# EasyEDA Pro project rp2040-mlx90393_1.epro

# Schematic Schematic3_4
Create Date: 2025-07-02; Page Name: P1; Project Name: RSCM; Schematic Name: Schematic3_4; Update Date: 2025-07-02; Company: 嘉立创EDA; Page Size: A4; Version: V1.0
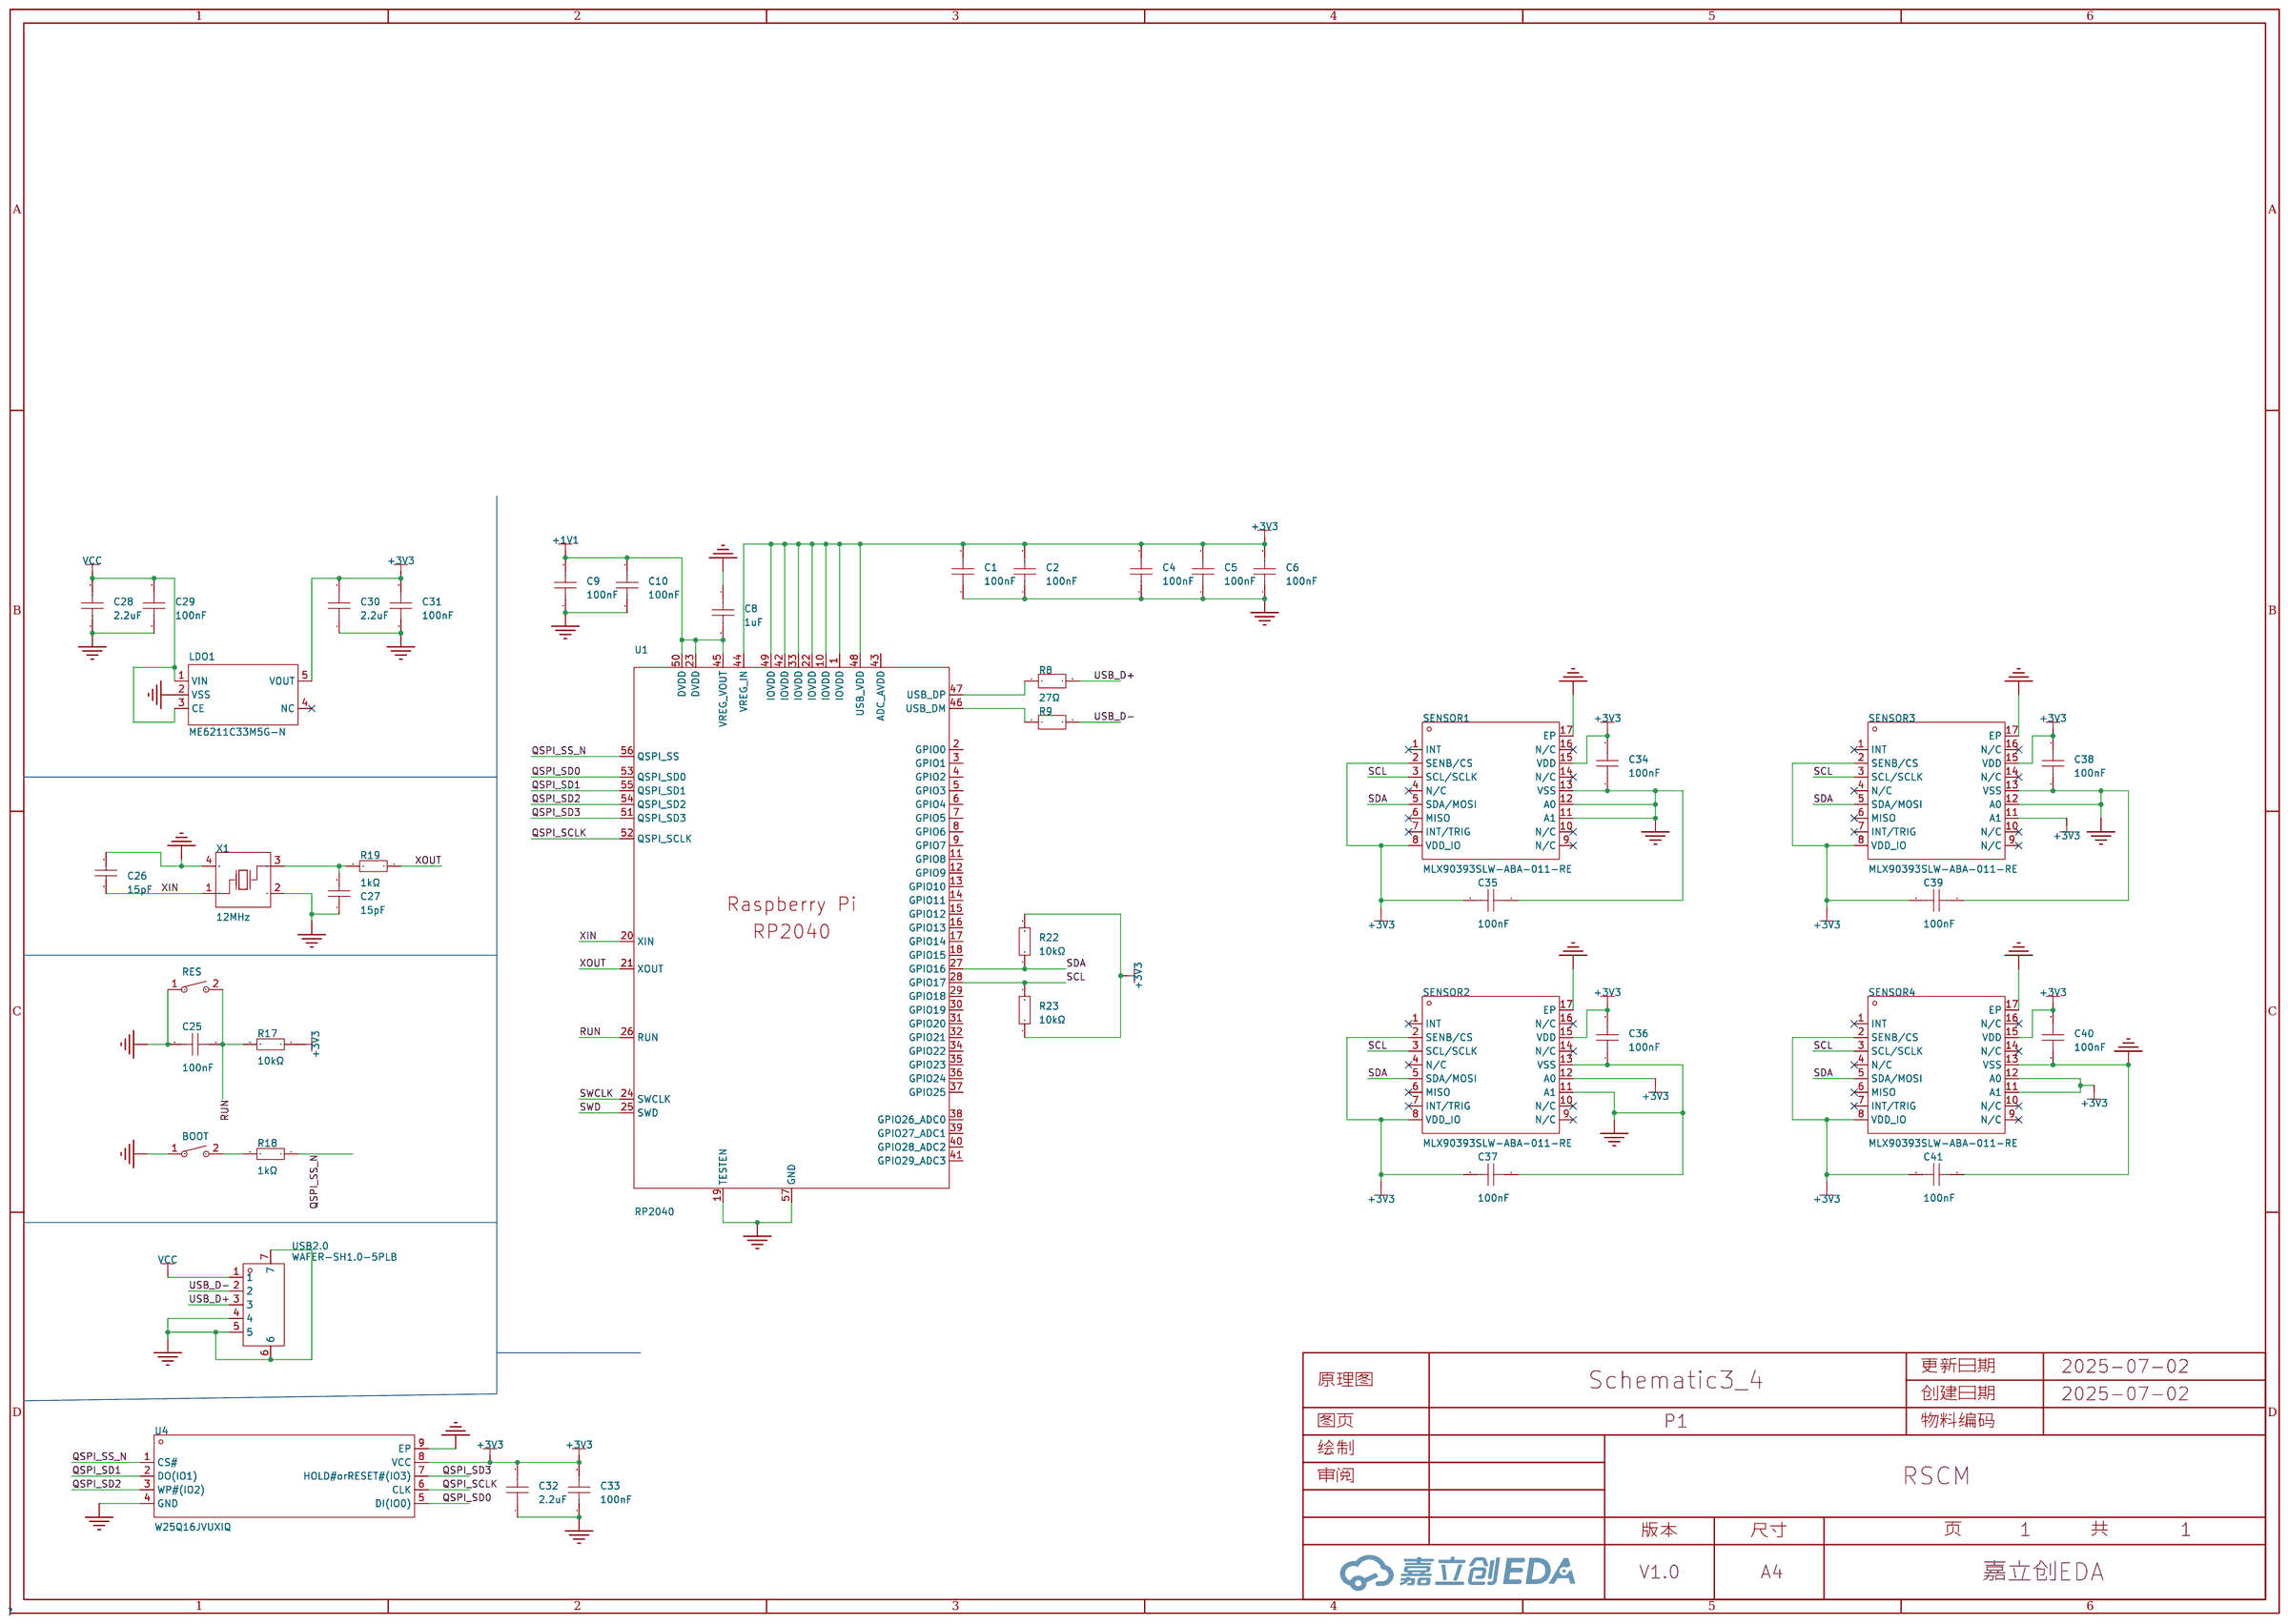
[diagram p0: schematic sheet]

## Parts
BOOT  TS-1071AD-A1B3-D4  [SW-SMD_L4.0-W3.0-LS4.8]
C1  100nF  [C0603]
C2  100nF  [C0603]
C4  100nF  [C0603]
C5  100nF  [C0603]
C6  100nF  [C0603]
C8  1uF  [C0603]
C9  100nF  [C0603]
C10  100nF  [C0603]
C25  100nF  [C0603]
C26  15pF  [C0603]
C27  15pF  [C0603]
C28  2.2uF  [C0603]
C29  100nF  [C0603]
C30  2.2uF  [C0603]
C31  100nF  [C0603]
C32  2.2uF  [C0603]
C33  100nF  [C0603]
C34  100nF  [C0603]
C35  100nF  [C0603]
C36  100nF  [C0603]
C37  100nF  [C0603]
C38  100nF  [C0603]
C39  100nF  [C0603]
C40  100nF  [C0603]
C41  100nF  [C0603]
LDO1  ME6211C33M5G-N  [SOT-23-5_L3.0-W1.7-P0.95-LS2.8-BL]
R8  27Ω  [R0603]
R9  27Ω  [R0603]
R17  10kΩ  [R0603]
R18  1kΩ  [R0603]
R19  1kΩ  [R0603]
R22  10kΩ  [R0603]
R23  10kΩ  [R0603]
RES  TS-1071AD-A1B3-D4  [SW-SMD_L4.0-W3.0-LS4.8]
SENSOR1  MLX90393SLW-ABA-011-RE  [VQFN-16_L3.0-W3.0-P0.50-BL-EP1.7]
SENSOR2  MLX90393SLW-ABA-011-RE  [VQFN-16_L3.0-W3.0-P0.50-BL-EP1.7]
SENSOR3  MLX90393SLW-ABA-011-RE  [VQFN-16_L3.0-W3.0-P0.50-BL-EP1.7]
SENSOR4  MLX90393SLW-ABA-011-RE  [VQFN-16_L3.0-W3.0-P0.50-BL-EP1.7]
U1  RP2040  [LQFN-56_L7.0-W7.0-P0.4-EP]
U4  W25Q16JVUXIQ  [USON-8_L3.0-W2.0-P0.50-BL-EP]
USB2.0  WAFER-SH1.0-5PLB  [CONN-SMD-5P-P1.00_BM05B-SRSS-TB-LF-SN]
X1  12MHz  [OSC-SMD_4P-L3.2-W2.5-BL]

## Library data of the parts
BOOT RES = TS-1071AD-A1B3-D4: 电路结构:单刀单掷;安装方式:-;按钮形状:圆形按钮;带灯:-;作用力:250gf@±30gf;开关长度:4mm;开关宽度:3mm;开关高度:2mm;; LCSC Part Name: 轻触开关4.0*3.0*2两脚贴片无柱小龟250gf; Supplier Part: C492878; Manufacturer: Yuandi(元迪); JLCPCB Part Class: Extended Part; Datasheet: https://atta.szlcsc.com/upload/public/pdf/source/20200316/C492878_F665FC46291D1CEBBF5F4DDB4422506A.pdf; Supplier: LCSC; Circuit: 单刀单掷; Actuator Style: 圆形按钮; Operating Force: 250gf@±30gf; Switch Length: 4mm; Switch Width: 3mm; Switch Height: 2mm
C1 C2 C4-C6 C9 C10 C25 C29 C31 C33-C41 = CGA0603X7R104K500JT: 容值:100nF;精度:±10%;额定电压:50V;材质(温度系数):X7R;; LCSC Part Name: 100nF ±10% 50V; Supplier Part: C6119867; Manufacturer: HRE(芯声); Supplier Footprint: 0603; JLCPCB Part Class: 扩展库; Supplier: LCSC; Tolerance: ±10%; Voltage Rated: 50V; Temperature Coefficient: X7R
C8 = CGA0603X5R105K500JT: 容值:1uF;精度:±10%;额定电压:50V;温度系数:X5R;; LCSC Part Name: 1uF ±10% 50V; Supplier Part: C6119852; Manufacturer: HRE(芯声); Supplier Footprint: 0603; JLCPCB Part Class: Extended Part; Supplier: LCSC; Tolerance: ±10%; Voltage Rating: 50V; Temperature Coefficient: X5R
C26 C27 = CC0603JRNPO9BN150: 容值:15pF;精度:±5%;额定电压:50V;材质(温度系数):NP0;; LCSC Part Name: 15pF ±5% 50V; Supplier Part: C107037; Manufacturer: YAGEO(国巨); Supplier Footprint: 0603; JLCPCB Part Class: 扩展库; Datasheet: https://atta.szlcsc.com/upload/public/pdf/source/20170914/C128857_1505359892143968080.pdf; Supplier: LCSC; Tolerance: ±5%; Voltage Rated: 50V; Temperature Coefficient: NP0
C28 C30 C32 = CL10A225KB8NNNC: 容值:2.2uF;精度:±10%;额定电压:50V;材质(温度系数):X5R;; LCSC Part Name: 2.2uF ±10% 50V; Supplier Part: C913904; Manufacturer: SAMSUNG(三星); Supplier Footprint: 0603; JLCPCB Part Class: Extended Part; Datasheet: https://atta.szlcsc.com/upload/public/pdf/source/20160218/1457707763339.pdf; Supplier: LCSC; Tolerance: ±10%; Voltage Rated: 50V; Temperature Coefficient: X5R
LDO1 = ME6211C33M5G-N: 输出类型:固定;工作电压:6V;输出电压:3.3V;输出电流:500mA;电源纹波抑制比(PSRR):70dB@(1kHz)；62dB@(10kHz);输出极性:正极;; LCSC Part Name: 输入6V 输出3.3V 500mA; Supplier Part: C82942; Manufacturer: MICRONE(南京微盟); Supplier Footprint: SOT-23-5; JLCPCB Part Class: 扩展库; Datasheet: https://atta.szlcsc.com/upload/public/pdf/source/20170918/C82942_1505727073070976520.pdf; Supplier: LCSC; Output Type: 固定; Voltage - Supply: 6V; Output Voltage: 3.3V; Output Current: 500mA; Power Supply Rejection Ratio (PSRR): 70dB@(1kHz)；62dB@(10kHz); Voltage Dropout: 260mV@(200mA); Features: 短路保护(SCP)；低ESR；过流保护(OCP)；带使能; Output Configuration: 正极; Number of Outputs: 1
R8 R9 = FRC0603F27R0TS: 电阻类型:厚膜电阻;阻值:27Ω;精度:±1%;功率:100mW;工作电压:75V;温度系数:±100ppm/℃;; LCSC Part Name: 27Ω ±1% 100mW 厚膜电阻; Supplier Part: C2907021; Manufacturer: FOJAN(富捷); Supplier Footprint: 0603; JLCPCB Part Class: Extended Part; Datasheet: https://atta.szlcsc.com/upload/public/pdf/source/20211221/925EC7D7225764EE0046F22065062C87.pdf; Supplier: LCSC; Type: 厚膜电阻; Tolerance: ±1%; Power(Watts): 100mW; Voltage-Supply(Max): 75V; Temperature Coefficient: ±100ppm/℃; Operating Temperature: -55℃~+155℃
R17 R18 = RC0603FR-0710KL: 电阻类型:厚膜电阻;阻值:10kΩ;精度:±1%;功率:100mW;; LCSC Part Name: 10kΩ ±1% 100mW; Supplier Part: C98220; Manufacturer: YAGEO(国巨); Supplier Footprint: 0603; JLCPCB Part Class: 扩展库; Datasheet: https://atta.szlcsc.com/upload/public/pdf/source/20170522/1495423494387.pdf; Supplier: LCSC; Type: 厚膜电阻; Tolerance: ±1%; Power(Watts): 100mW; Temperature Coefficient: ±100ppm/℃; Overload Voltage (Max): 75V; Operating Temperature Range: -55℃~+155℃
R19 = 0603WAF1001T5E: 电阻类型:厚膜电阻;阻值:1kΩ;精度:±1%;功率:100mW;最大工作电压:75V;温度系数:±100ppm/℃;; LCSC Part Name: 1kΩ ±1% 100mW 厚膜电阻; Supplier Part: C21190; Manufacturer: UNI-ROYAL(厚声); Supplier Footprint: 0603; JLCPCB Part Class: 基础库; Datasheet: https://atta.szlcsc.com/upload/public/pdf/source/20200306/C422600_1E6D84923E4A46A82E41ADD87F860B5C.pdf; Supplier: LCSC; Type: 厚膜电阻; Tolerance: ±1%; Power(Watts): 100mW; Overload Voltage (Max): 75V; Temperature Coefficient: ±100ppm/℃; Operating Temperature Range: -55℃~+155℃
R22 R23 = 0603WAF4701T5E: 电阻类型:厚膜电阻;阻值:4.7kΩ;精度:±1%;功率:100mW;最大工作电压:75V;温度系数:±100ppm/℃;; LCSC Part Name: 4.7kΩ ±1% 100mW 厚膜电阻; Supplier Part: C23162; Manufacturer: UNI-ROYAL(厚声); Supplier Footprint: 0603; JLCPCB Part Class: Basic Part; Datasheet: https://atta.szlcsc.com/upload/public/pdf/source/20200306/C422600_1E6D84923E4A46A82E41ADD87F860B5C.pdf; Supplier: LCSC; Type: 厚膜电阻; Tolerance: ±1%; Power(Watts): 100mW; Overload Voltage (Max): 75V; Temperature Coefficient: ±100ppm/℃; Operating Temperature Range: -55℃~+155℃
SENSOR1-SENSOR4 = MLX90393SLW-ABA-011-RE: 三轴磁传感器; LCSC Part Name: 三轴磁传感器; Supplier Part: C2649492; Manufacturer: Melexis(比利时迈来芯); Supplier Footprint: QFN-16-EP(3x3); JLCPCB Part Class: 扩展库; Datasheet: https://atta.szlcsc.com/upload/public/pdf/source/20211126/C4B8913B6F87EBCF004CDCA59E4924D2.pdf; Supplier: LCSC
U1 = RP2040_C2040: CPU内核:-;CPU最大主频:133MHz;应用领域:-;; LCSC Part Name: RP2040（RP2B2）; Supplier Part: C2040; Manufacturer: Raspberry Pi(树莓派); Supplier Footprint: LQFN-56(7x7); JLCPCB Part Class: Extended Part; Datasheet: https://atta.szlcsc.com/upload/public/pdf/source/20210621/C2040_96F425825606B7957D87DD32E2512CA9.pdf; Supplier: LCSC; CPU Maximum Speed: 133MHz; Number of I/O: 30; ADC (Bit): 12bit
U4 = W25Q16JVUXIQ: Supplier Part: C2843335; Manufacturer: WINBOND(华邦); Supplier Footprint: USON-8-EP(2x3); JLCPCB Part Class: 扩展库; Datasheet: https://atta.szlcsc.com/upload/public/pdf/source/20210629/C2843335_FB4D78B5076715625DC0C83F790D3044.pdf; Supplier: LCSC
USB2.0 = WAFER-SH1.0-5PLB: 插针结构:1x5P;间距:1mm;安装方式:立贴;参考系列:SH;总PIN数:5P;排数:1;每排PIN数:5;行距:-;额定电流:1A;触头材质:黄铜;触头镀层:-;工作温度:-25℃~+85℃;; LCSC Part Name: 1x5P 间距:1mm 立贴 系列:SH; Supplier Part: C3029335; Manufacturer: XUNPU(讯普); Supplier Footprint: SMD,P=1mm; JLCPCB Part Class: 扩展库; Datasheet: https://atta.szlcsc.com/upload/public/pdf/source/20220527/2BC543D78697EB0EE4D2C73A161B184B.pdf; Supplier: LCSC; Pins Structure: 1x5P; Pitch: 1mm; Mounting Type: 立贴; Reference Series: SH; Number of Pins: 5P; Number of Rows: 1; Number of PINs Per Row: 5; Current Rating: 1A; Contact Material: 黄铜; Operating Temperature: -25℃~+85℃; Voltage Rating: 50V; Plastic Material: LCP; Supplementary Features: 辅助焊脚; Color: 米色; Z-Height of the Board: 4.4mm; X-Length of Bottom Edge on Board (Spacing Line): 7.35mm; Y-Width of Bottom Edge on Board: 3.74mm
X1 = X322512MSB4SI: 晶振类型:贴片晶振;频率:12MHz;常温频差:±10ppm;外接负载电容:20pF;频率稳定度(全温):±20ppm;; LCSC Part Name: 12MHz ±10ppm 20pF; Supplier Part: C9002; Manufacturer: YXC(扬兴晶振); Supplier Footprint: SMD3225-4P; JLCPCB Part Class: 基础库; Datasheet: https://atta.szlcsc.com/upload/public/pdf/source/20240329/19D5F850207469550BEB00D7DFEDBC7A.pdf; Supplier: LCSC; Crystal Type: 贴片晶振; Normal temperature Frequency Tolerance: ±10ppm; External load capacitor: 20pF; Frequency Stability(Full temperature range): ±20ppm; Operating Temperature: -40℃~+85℃

## Nets
+1V1: C8.2 C9.2 C10.2 U1.23(DVDD) U1.45(VREG_VOUT) U1.50(DVDD)
+3V3: C1.2 C2.2 C4.2 C5.2 C6.2 C30.2 C31.2 C32.2 C33.2 C34.2 C35.2 C36.2 C37.2 C38.2 C39.2 C40.2 C41.2 LDO1.5(VOUT) R17.1 R22.2 R23.1 SENSOR1.2(SENB/CS) SENSOR1.8(VDD_IO) SENSOR1.15(VDD) SENSOR2.2(SENB/CS) SENSOR2.8(VDD_IO) SENSOR2.12(A0) SENSOR2.15(VDD) SENSOR3.2(SENB/CS) SENSOR3.8(VDD_IO) SENSOR3.11(A1) SENSOR3.15(VDD) SENSOR4.2(SENB/CS) SENSOR4.8(VDD_IO) SENSOR4.11(A1) SENSOR4.12(A0) SENSOR4.15(VDD) U1.1(IOVDD) U1.10(IOVDD) U1.22(IOVDD) U1.33(IOVDD) U1.42(IOVDD) U1.44(VREG_IN) U1.48(USB_VDD) U1.49(IOVDD) U4.8(VCC)
GND: BOOT.1 C1.1 C2.1 C4.1 C5.1 C6.1 C8.1 C9.1 C10.1 C25.1 C26.2 C27.1 C28.1 C29.1 C30.1 C31.1 C32.1 C33.1 C34.1 C35.1 C36.1 C37.1 C38.1 C39.1 C40.1 C41.1 LDO1.2(VSS) RES.1 SENSOR1.11(A1) SENSOR1.12(A0) SENSOR1.13(VSS) SENSOR1.17(EP) SENSOR2.11(A1) SENSOR2.13(VSS) SENSOR2.17(EP) SENSOR3.12(A0) SENSOR3.13(VSS) SENSOR3.17(EP) SENSOR4.13(VSS) SENSOR4.17(EP) U1.19(TESTEN) U1.57(GND) U4.4(GND) U4.9(EP) USB2.0.4 USB2.0.5 USB2.0.6 USB2.0.7 X1.2(GND) X1.4(GND)
VCC: C28.2 C29.2 LDO1.1(VIN) LDO1.3(CE) USB2.0.1
QSPI_SCLK: U1.52(QSPI_SCLK) U4.6(CLK)
QSPI_SD0: U1.53(QSPI_SD0) U4.5(DI(IO0))
QSPI_SD1: U1.55(QSPI_SD1) U4.2(DO(IO1))
QSPI_SD2: U1.54(QSPI_SD2) U4.3(WP#(IO2))
QSPI_SD3: U1.51(QSPI_SD3) U4.7(HOLD#orRESET#(IO3))
QSPI_SS_N: R18.1 U1.56(QSPI_SS) U4.1(CS#)
RUN: C25.2 R17.2 RES.2 U1.26(RUN)
SCL: R23.2 SENSOR1.3(SCL/SCLK) SENSOR2.3(SCL/SCLK) SENSOR3.3(SCL/SCLK) SENSOR4.3(SCL/SCLK) U1.28(GPIO17)
SDA: R22.1 SENSOR1.5(SDA/MOSI) SENSOR2.5(SDA/MOSI) SENSOR3.5(SDA/MOSI) SENSOR4.5(SDA/MOSI) U1.27(GPIO16)
SWCLK: U1.24(SWCLK)
SWD: U1.25(SWD)
USB_D+: R8.2 USB2.0.3
USB_D-: R9.2 USB2.0.2
XIN: C26.1 U1.20(XIN) X1.1(OSC1)
XOUT: R19.1 U1.21(XOUT)
$1N2913: R8.1 U1.47(USB_DP)
$1N2917: R9.1 U1.46(USB_DM)
$1N3876: BOOT.2 R18.2
$1N4061: C27.2 R19.2 X1.3(OSC2)

Not connected (* = marked no-connect by the designer): LDO1 4(NC)*; SENSOR1 1(INT)* 4(N/C)* 6(MISO)* 7(INT/TRIG)* 9(N/C)* 10(N/C)* 14(N/C)* 16(N/C)*; SENSOR2 1(INT)* 4(N/C)* 6(MISO)* 7(INT/TRIG)* 9(N/C)* 10(N/C)* 14(N/C)* 16(N/C)*; SENSOR3 1(INT)* 4(N/C)* 6(MISO)* 7(INT/TRIG)* 9(N/C)* 10(N/C)* 14(N/C)* 16(N/C)*; SENSOR4 1(INT)* 4(N/C)* 6(MISO)* 7(INT/TRIG)* 9(N/C)* 10(N/C)* 14(N/C)* 16(N/C)*; U1 2(GPIO0) 3(GPIO1) 4(GPIO2) 5(GPIO3) 6(GPIO4) 7(GPIO5) 8(GPIO6) 9(GPIO7) 11(GPIO8) 12(GPIO9) 13(GPIO10) 14(GPIO11) 15(GPIO12) 16(GPIO13) 17(GPIO14) 18(GPIO15) 29(GPIO18) 30(GPIO19) 31(GPIO20) 32(GPIO21) 34(GPIO22) 35(GPIO23) 36(GPIO24) 37(GPIO25) 38(GPIO26_ADC0) 39(GPIO27_ADC1) 40(GPIO28_ADC2) 41(GPIO29_ADC3) 43(ADC_AVDD)

# Board PCB16_4
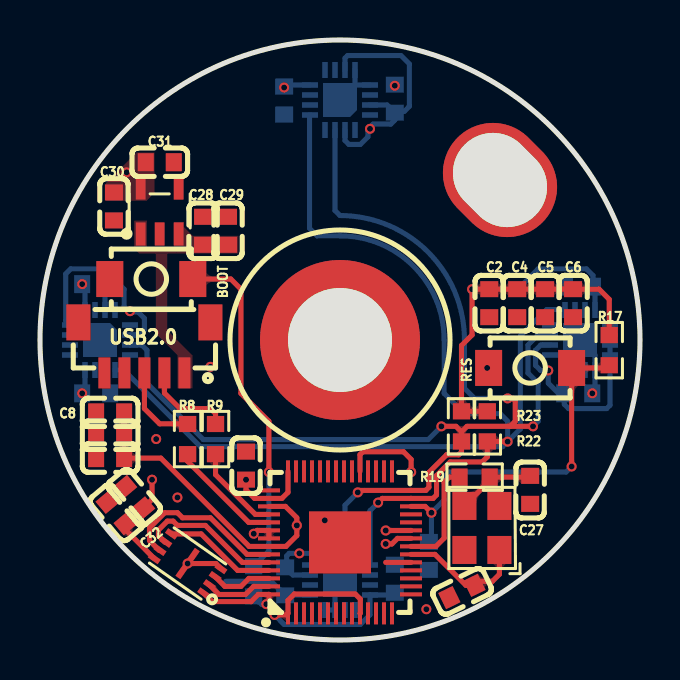
[diagram p1: board, top side]
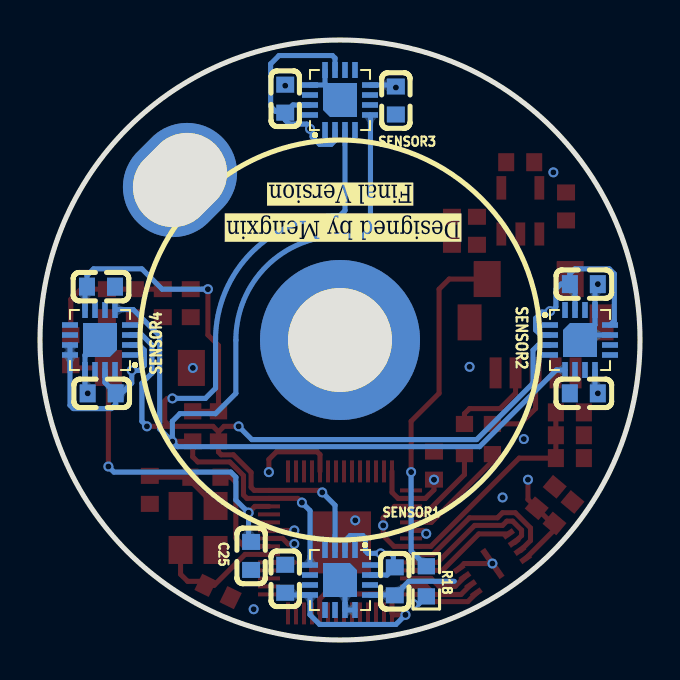
[diagram p2: board, bottom side, seen from below]

Outline 30 x 30 mm; copper layers: Top Layer, GND, POWR, Bottom Layer. Coordinates in mm from the lower left corner of the outline.
Outline path: circle c15,15 r15
Stack: Top Layer 0.035mm 外层铜厚1oz / Dielectric1 0.2104mm 7628 RC49% 8.6mil / GND 0.0152mm 内层铜厚 / Dielectric2 1.065mm 1.1mm H/HOZ 含铜 / POWR 0.0152mm 内层铜厚 / Dielectric3 0.2104mm 7628 RC49% 8.6mil / Bottom Layer 0.035mm 外层铜厚1oz

## Design rules (mm)
template: JLCPCB Capability(Two Layers Board)
spacing copperThickness1oz (default): track to track 0.102, other pairs 0.152 to 0.3
spacing copperThickness2oz: track to track 0.203, other pairs 0.152 to 0.3
track width copperThickness1oz (default): min 0.127, default 0.254, max 2.54
track width copperThickness2oz: min 0.203, default 0.254, max 2.54
differential pair differentialPair (default): width min 0.127, default 0.254, max 2.54; gap min 0.152, default 0.152
via viaSize (default): diameter min 0.5, default 0.61, max 10; hole min 0.3, default 0.305, max 6.3

## Placement (name value [footprint] x y rotation side)
BOOT  TS-1071AD-A1B3-D4  [SW-SMD_L4.0-W3.0-LS4.8]  5.56 18.05 0 top
C1  100nF  [C0603]  10.3 8.72 270 top
C2  100nF  [C0603]  22.46 16.84 90 top
C4  100nF  [C0603]  23.86 16.84 90 top
C5  100nF  [C0603]  25.26 16.84 90 top
C6  100nF  [C0603]  26.65 16.84 90 top
C8  1uF  [C0603]  3.51 11.38 0 top
C9  100nF  [C0603]  3.51 10.24 0 top
C10  100nF  [C0603]  3.51 9.09 0 top
C25  100nF  [C0603]  19.44 4.2 90 bottom
C26  15pF  [C0603]  21.1 2.43 206 top
C27  15pF  [C0603]  24.51 7.51 90 top
C28  2.2uF  [C0603]  8.15 20.46 270 top
C29  100nF  [C0603]  9.4 20.46 270 top
C30  2.2uF  [C0603]  3.7 21.68 90 top
C31  100nF  [C0603]  5.99 23.89 180 top
C32  2.2uF  [C0603]  3.82 6.36 310 top
C33  100nF  [C0603]  4.71 7.13 310 top
C34  100nF  [C0603]  12.26 2.94 90 bottom
C35  100nF  [C0603]  17.74 3.06 270 bottom
C36  100nF  [C0603]  2.81 17.79 0 bottom
C37  100nF  [C0603]  2.81 12.33 180 bottom
C38  100nF  [C0603]  17.74 27.06 270 bottom
C39  100nF  [C0603]  12.21 26.97 90 bottom
C40  100nF  [C0603]  26.95 17.67 0 bottom
C41  100nF  [C0603]  26.91 12.33 180 bottom
LDO1  ME6211C33M5G-N  [SOT-23-5_L3.0-W1.7-P0.95-LS2.8-BL]  5.98 21.45 0 top
NOREF  -  [Pad_e4640]  23 23 315 top
NOREF#2  -  [Pad_e22166]  15 15 0 top
R8  27Ω  [R0603]  7.38 10.05 90 top
R9  27Ω  [R0603]  8.78 10.05 90 top
R17  10kΩ  [R0603]  28.46 14.49 270 top
R18  1kΩ  [R0603]  10.68 2.94 90 bottom
R19  1kΩ  [R0603]  21.73 8.14 0 top
R22  10kΩ  [R0603]  22.37 10.68 90 top
R23  10kΩ  [R0603]  21.08 10.68 270 top
RES  TS-1071AD-A1B3-D4  [SW-SMD_L4.0-W3.0-LS4.8]  24.51 13.6 0 top
SENSOR1  MLX90393SLW-ABA-011-RE  [vqfn-16_l3.0-w3.0-p0.50-bl-ep1.7]  15 3 0 bottom
SENSOR2  MLX90393SLW-ABA-011-RE  [VQFN-16_L3.0-W3.0-P0.50-BL-EP1.7]  3 15 270 bottom
SENSOR3  MLX90393SLW-ABA-011-RE  [VQFN-16_L3.0-W3.0-P0.50-BL-EP1.7]  15 27 180 bottom
SENSOR4  MLX90393SLW-ABA-011-RE  [VQFN-16_L3.0-W3.0-P0.50-BL-EP1.7]  27 15 90 bottom
U1  RP2040  [LQFN-56_L7.0-W7.0-P0.4-EP]  15 4.88 90 top
U4  W25Q16JVUXIQ  [USON-8_L3.0-W2.0-P0.50-BL-EP]  7.38 3.82 55 top
USB2.0  WAFER-SH1.0-5PLB  [CONN-SMD-5P-P1.00_BM05B-SRSS-TB-LF-SN]  5.22 14.62 180 top
X1  12MHz  [OSC-SMD_4P-L3.2-W2.5-BL]  22.1 5.6 90 top

## Footprints (pads in the part's own frame, mm; a bottom-side part is the same pattern mirrored in y, then rotated)
C0603
  rect 0.8x0.9 smd: 1(-0.7,0) 2(0.7,0)
CONN-SMD-5P-P1.00_BM05B-SRSS-TB-LF-SN
  rect 0.6x1.55 smd: 1(-2,1.262) 2(-1,1.262) 3(0,1.262) 4(1,1.262) 5(2,1.262)
  rect 1.2x1.8 smd: 6(3.3,-1.262) 7(-3.3,-1.262)
LQFN-56_L7.0-W7.0-P0.4-EP
  rect 1.1x0.2 smd: 1(-3.55,2.6) 2(-3.55,2.2) 3(-3.55,1.8) 4(-3.55,1.4) 5(-3.55,1) 6(-3.55,0.6) 7(-3.55,0.2) 8(-3.55,-0.2) 9(-3.55,-0.6) 10(-3.55,-1) 11(-3.55,-1.4) 12(-3.55,-1.8) 13(-3.55,-2.2) 14(-3.55,-2.6) 29(3.55,-2.6) 30(3.55,-2.2) 31(3.55,-1.8) 32(3.55,-1.4) 33(3.55,-1) 34(3.55,-0.6) 35(3.55,-0.2) 36(3.55,0.2) 37(3.55,0.6) 38(3.55,1) 39(3.55,1.4) 40(3.55,1.8) 41(3.55,2.2) 42(3.55,2.6)
  rect 0.2x1.1 smd: 15(-2.6,-3.55) 16(-2.2,-3.55) 17(-1.8,-3.55) 18(-1.4,-3.55) 19(-1,-3.55) 20(-0.6,-3.55) 21(-0.2,-3.55) 22(0.2,-3.55) 23(0.6,-3.55) 24(1,-3.55) 25(1.4,-3.55) 26(1.8,-3.55) 27(2.2,-3.55) 28(2.6,-3.55) 43(2.6,3.55) 44(2.2,3.55) 45(1.8,3.55) 46(1.4,3.55) 47(1,3.55) 48(0.6,3.55) 49(0.2,3.55) 50(-0.2,3.55) 51(-0.6,3.55) 52(-1,3.55) 53(-1.4,3.55) 54(-1.8,3.55) 55(-2.2,3.55) 56(-2.6,3.55)
  rect 3.1x3.1 smd: 57(0,0)
OSC-SMD_4P-L3.2-W2.5-BL
  rect 1.4x1.2 smd: 1(-1.1,-0.875) 2(1.1,-0.875) 3(1.1,0.875) 4(-1.1,0.875)
Pad_e4640
  oval 6x5 hole 5x4: 58(0,0)
Pad_e22166
  round 8 hole 5.2: 1(0,0)
R0603
  rect 0.806x0.864 smd: 1(-0.753,0) 2(0.753,0)
SOT-23-5_L3.0-W1.7-P0.95-LS2.8-BL
  rect 0.49x1.157 smd: 1(-0.95,-1.153) 2(0,-1.153) 3(0.95,-1.153)
  rect 0.49x1.175 smd: 4(0.95,1.153) 5(-0.95,1.153)
SW-SMD_L4.0-W3.0-LS4.8
  rect 1.35x1.8 smd: 1(-2.075,0) 2(2.075,0)
USON-8_L3.0-W2.0-P0.50-BL-EP
  rect 0.28x0.6 smd: 1(-0.75,-1.508) 2(-0.25,-1.508) 3(0.25,-1.508) 4(0.75,-1.508) 5(0.75,1.508) 6(0.25,1.508) 7(-0.25,1.508) 8(-0.75,1.508)
  rect 1.7x0.3 smd: 9(0,0)
vqfn-16_l3.0-w3.0-p0.50-bl-ep1.7
  rect 0.28x0.8 smd: 1(-0.749,-1.5) 2(-0.249,-1.5) 3(0.249,-1.5) 4(0.75,-1.5) 9(0.75,1.5) 10(0.249,1.5) 11(-0.249,1.5) 12(-0.749,1.5)
  rect 0.8x0.28 smd: 5(1.5,-0.749) 6(1.5,-0.249) 7(1.5,0.249) 8(1.5,0.75) 13(-1.5,0.75) 14(-1.5,0.249) 15(-1.5,-0.249) 16(-1.5,-0.749)
  custom 1.7x1.7 smd: 17(0,0)
VQFN-16_L3.0-W3.0-P0.50-BL-EP1.7
  rect 0.28x0.8 smd: 1(-0.749,-1.5) 2(-0.249,-1.5) 3(0.249,-1.5) 4(0.75,-1.5) 9(0.75,1.5) 10(0.249,1.5) 11(-0.249,1.5) 12(-0.749,1.5)
  rect 0.8x0.28 smd: 5(1.5,-0.749) 6(1.5,-0.249) 7(1.5,0.249) 8(1.5,0.75) 13(-1.5,0.75) 14(-1.5,0.249) 15(-1.5,-0.249) 16(-1.5,-0.749)
  custom 1.7x1.7 smd: 17(0,0)

## Nets
As in the schematic, except:
GND: BOOT.1 C1.1 C2.1 C4.1 C5.1 C6.1 C8.1 C9.1 C10.1 C25.1 C26.2 C27.1 C28.1 C29.1 C30.1 C31.1 C32.1 C33.1 C34.1 C35.1 C36.1 C37.1 C38.1 C39.1 C40.1 C41.1 LDO1.2 NOREF.58 NOREF#2.1 RES.1 SENSOR1.11 SENSOR1.12 SENSOR1.13 SENSOR1.17 SENSOR2.11 SENSOR2.13 SENSOR2.17 SENSOR3.12 SENSOR3.13 SENSOR3.17 SENSOR4.13 SENSOR4.17 U1.19 U1.57 U4.4 U4.9 USB2.0.4 USB2.0.5 USB2.0.6 USB2.0.7 X1.2 X1.4

Pads without a net: LDO1 4; SENSOR1 1 4 6 7 9 10 14 16; SENSOR2 1 4 6 7 9 10 14 16; SENSOR3 1 4 6 7 9 10 14 16; SENSOR4 1 4 6 7 9 10 14 16; U1 2 3 4 5 6 7 8 9 11 12 13 14 15 16 17 18 29 30 31 32 34 35 36 37 38 39 40 41 43

## Via types
v1: diameter 0.5, hole 0.3, Top Layer to Bottom Layer, 30 vias
v2: diameter 0.508, hole 0.305, Top Layer to Bottom Layer, 6 vias

## Routing (per net, layer and track width the routed paths; a pad name or vN(x,y) marks a point on that pad's centre or on a via; arc(x,y) is an arc through that point)
+1V1: length 21.5
  Top Layer w0.254: v2(17.29,5.47) 18.54,5.47 U1.23 ; U1.45 12.27,6.68 12.84,6.11 v2(12.84,5.73) 12.84,5.22 12.3,4.68 U1.50 10.46,4.68 6.04,9.09 C10.2 C9.2 C8.2
  POWR w0.254: v2(12.84,5.73) 13.35,5.22 15,5.22 15.25,5.47 v2(17.29,5.47)
+3V3: length 181.7
  Top Layer w0.254: 10.3,8.02 10.3,7.51 10.73,7.08 U1.44 12.09,7.08 12.4,7.39 U1.42 ; v1(5.6,8.02) 5.6,7.03 4.4,5.83 C32.2 4.27,5.52 5.72,4.07 ; U1.10 16.02,1.35 16.02,2.05 15.76,2.3 12.71,2.3 12.4,1.99 U1.1 12.33,1.26 v2(11.73,1.26) ; v1(10.69,5.31) 10.86,5.48 U1.48 U1.49 ; U1.22 17.87,5.08 17.6,4.8 v1(17.28,4.8) ; C2.2 C4.2 C5.2 C6.2 ; R17.1 28.46,17.03 27.95,17.54 26.66,17.54 ; U1.33 16,9.27 16.14,9.41 18.18,9.41 18.56,9.03 v2(18.56,8.4) ; 22.46,17.54 v1(21.6,17.54) 21.6,15.25 21.08,14.73 R23.1 R22.2
  POWR w0.254: 10.68,4.59 10.94,4.33 v1(12.97,4.33) 16.81,4.33 v1(17.28,4.8) ; 10.68,4.59 10.68,5.31 v1(10.69,5.31) 10.69,7.63 10.56,7.76 ; 10.68,4.59 10.56,4.46 10.56,1.67 10.96,1.26 v2(11.73,1.26) ; 4.46,12.71 4.08,12.33 v1(2.11,12.33) ; 4.46,12.71 4.46,9.16 v1(5.6,8.02) v2(10.3,8.02) 10.56,7.76 ; 4.46,12.71 4.46,16.4 v1(4.5,16.44) 4.33,16.61 v1(4.33,23.38) 9.28,23.38 ; 10.56,7.76 15.13,7.76 15.38,8.02 18.18,8.02 v2(18.56,8.4) ; v1(16.5,25.56) 16.52,25.54 16.52,23.76 16.14,23.38 ; 16.14,23.38 17.79,23.38 19.32,21.86 19.32,19.19 20.97,17.54 v1(21.6,17.54) 25.29,17.54 25.41,17.41 v1(25.41,13.48) ; 16.14,23.38 9.28,23.38 ; 9.28,23.38 9.92,24.02 9.92,26.68 10.81,27.57 12.16,27.57 v1(12.21,27.62)
  Bottom Layer w0.254: C38.2 17.8,26.43 18.22,26.43 18.47,26.68 18.47,28.8 18.05,29.22 15.38,29.22 15.25,29.09 SENSOR3.11 ; C38.2 17.74,25.99 17.54,25.8 16.65,25.8 16.4,25.54 16.4,25.16 16.02,24.78 15.44,24.78 15.25,24.97 SENSOR3.2 ; C38.2 17.35,26.75 SENSOR3.15 ; SENSOR4.8 27.75,17.57 27.65,17.67 27.65,18.22 27.32,18.56 24.91,18.56 23.89,17.54 v1(21.6,17.54) ; C35.2 17.63,2.25 SENSOR1.8 16.5,1.26 16.02,0.78 12.21,0.78 v2(11.73,1.26) ; SENSOR2.2 4.97,15.25 5.22,15.5 5.22,16.08 4.91,16.4 4.46,16.4 4.21,16.65 4.21,17.54 3.95,17.79 C36.2 ; SENSOR4.2 25.04,14.75 24.78,14.49 24.78,13.73 25.03,13.48 v1(25.41,13.48) 25.41,12.84 25.92,12.33 C41.2 ; C41.2 26.75,12.87 SENSOR4.15 ; C41.2 26.21,11.79 26.43,11.57 28.34,11.57 28.5,11.74 SENSOR4.12 SENSOR4.11 ; SENSOR2.8 2.25,12.48 v1(2.11,12.33) ; SENSOR1.15 12.65,3.25 C34.2 12.33,3.71 12.33,4.2 12.46,4.33 v1(12.97,4.33) 13.6,4.33 13.73,4.46 13.73,5.09 13.86,5.22 14.49,5.22 14.75,4.96 SENSOR1.2 ; C39.2 12.28,27.75 SENSOR3.8 ; C36.2 3.51,18.3 3.25,18.56 1.54,18.56 1.28,18.3 1.28,15.97 SENSOR2.12 ; C36.2 3.25,17.53 SENSOR2.15
GND: length 19.7
  Top Layer w0.254: U1.19 17.29,3.88 ; v1(7.38,3.82) 8.79,3.82 9.04,3.57
  Bottom Layer w0.254: SENSOR2.11 2.75,15.25 ; 2.75,15.25 2.25,15.75 SENSOR2.13 2.25,17.65 v1(2.11,17.79) ; 2.75,15.25 SENSOR2.17 ; SENSOR3.13 15.75,27.75 ; 15.75,27.75 SENSOR3.17 ; 15.75,27.75 SENSOR3.12 ; SENSOR1.13 12.28,2.25 C34.1 11.56,2.94 9.28,2.94 ; 14.25,1.5 SENSOR1.11 14.75,2.75 SENSOR1.17 ; SENSOR4.17 27.75,14.25 SENSOR4.13 27.75,12.47 v1(27.61,12.33)
  vias: v1(5.81,10.05) v1(6.87,7.13) v1(8.52,13.66) v1(14.24,5.98) v1(17.74,27.72) v1(19.32,1.54) v1(22.36,13.6)
QSPI_SCLK: length 7.3
  Top Layer w0.254: U1.52 10.12,3.88 8.27,5.73 6.87,5.73 6.66,5.94 6.37,5.94 5.92,5.5 5.92,5.22 6.25,4.89 U4.6
QSPI_SD0: length 5.6
  Top Layer w0.254: U1.53 9.88,3.48 8.06,5.3 U4.5
QSPI_SD1: length 3.3
  Top Layer w0.254: U1.55 10.68,2.68 10.28,2.28 8.95,2.28 U4.2
QSPI_SD2: length 3.1
  Top Layer w0.254: U4.3 9.24,2.68 10.05,2.68 10.45,3.08 U1.54
QSPI_SD3: length 8.5
  Top Layer w0.254: U4.7 5.96,4.48 5.47,4.97 5.47,5.6 6.24,6.36 6.87,6.36 7.13,6.11 8.52,6.11 10.35,4.28 U1.51
QSPI_SS_N: length 4.9
  Top Layer w0.254: U4.1 8.61,1.92 10.56,1.92 10.92,2.28 U1.56 11.45,1.92 v1(11.32,1.79)
  Bottom Layer w0.254: R18.1 11.07,1.79 v1(11.32,1.79)
RUN: length 18.2
  Top Layer w0.254: R17.2 28.33,13.6 RES.2 v1(26.58,8.67) 26.56,8.65 ; v2(19.57,6.36) 19.26,6.68 U1.26
  Bottom Layer w0.254: v1(26.58,8.67) 26.3,8.4 20.46,8.4 20.21,8.14 20.21,7 v2(19.57,6.36) 19.57,5.03 C25.2
SCL: length 60.6
  Top Layer w0.254: 23.51,10.68 23.76,10.94 23.76,11.95 23.64,12.08 v1(23.38,12.08) ; 23.51,10.68 21.35,10.68 21.08,10.41 ; 23.51,10.68 v1(24.65,10.68) ; 21.08,10.41 20.8,10.68 v1(20.07,10.68) ; 21.08,10.41 R23.2 21.08,9.4 20.94,9.26 20.33,9.26 19.44,8.38 19.44,7.63 19.29,7.48 U1.28 15.99,7.48 v1(15.89,7.38)
  Bottom Layer w0.254: 21.22,15 arc(19.4,19.4) 15,21.22 14.75,21.47 SENSOR3.3 ; SENSOR4.3 25.5,15.25 24.91,15.25 24.4,14.75 24.4,13.35 24.91,12.84 24.91,10.94 v1(24.65,10.68) ; v1(15.89,7.38) 15.25,6.74 SENSOR1.3 ; SENSOR2.3 4.5,14.75 5.09,14.75 5.35,14.49 5.35,12.84 8.17,10.02 19.41,10.02 v1(20.07,10.68) ; 21.22,15 21.22,12.59 21.73,12.08 v1(23.38,12.08)
SDA: length 64.7
  Top Layer w0.254: v1(23.38,9.92) 23.37,9.93 R22.1 22.37,9.16 22.11,8.9 20.51,8.9 19.83,8.22 19.83,7.25 19.65,7.08 U1.27 17.11,7.08 v1(16.91,6.87)
  Bottom Layer w0.254: 20.21,15 arc(18.68,18.68) 15,20.21 13.86,20.21 13.48,20.59 13.48,26.23 SENSOR3.5 ; SENSOR4.5 26.23,16.52 25.34,16.52 24.02,15.2 24.02,10.56 v1(23.38,9.92) ; 20.21,15 20.21,12.33 21.22,11.32 23,11.32 23.38,10.94 v1(23.38,9.92) ; SENSOR2.5 4.19,13.5 8.02,9.67 23.13,9.67 v1(23.38,9.92) ; SENSOR1.5 16.5,6.47 v1(16.91,6.87)
USB_D+: length 4.3
  Top Layer w0.254: R8.2 7.37,10.81 5.98,10.81 5.22,11.57 USB2.0.3
USB_D-: length 4.5
  Top Layer w0.254: R9.2 8.78,11.32 8.52,11.57 7,11.57 6.22,12.35 USB2.0.2
XIN: length 6.5
  Top Layer w0.254: U1.20 19.75,4.28 21.29,2.73 21.72,2.73 21.93,2.94 22.62,2.94 22.97,3.29 X1.1
XOUT: length 5.5
  Top Layer w0.254: U1.21 19.79,4.68 20.21,5.09 20.21,7.89 20.46,8.14 R19.1
$1N2913: length 5.7
  Top Layer w0.254: R8.1 7.38,8.93 10.43,5.88 U1.47
$1N2917: length 4.5
  Top Layer w0.254: R9.1 8.78,8.27 10.77,6.28 U1.46
$1N3876: length 17.4
  Top Layer w0.254: BOOT.2 9.54,18.05 10.05,17.54 10.05,12.33 11.44,10.94 v1(11.44,8.4)
  Bottom Layer w0.254: v1(11.44,8.4) 11.44,4.45 R18.2
$1N4061: length 4
  Top Layer w0.254: X1.3 22.48,7.96 R19.2 24.44,8.14 C27.2

## Copper pours and planes (outline as drawn; the poured copper is in the pictures)
+3V3 on Top Layer: 3.3,24.37 5.73,24.37 5.73,21.96 3.3,21.96
+3V3 on Top Layer: 3.32,24.37 4.84,24.37 4.84,22.87 3.32,22.87
GND on Top Layer: -4.05,33.16 33.16,33.16 33.16,-3.8 -4.05,-3.8
GND on Bottom Layer: -4.05,33.16 33.16,33.16 33.16,-3.8 -4.05,-3.8
GND on GND: 22.87,23.13 25.43,23.13 25.43,20.57 22.87,20.57
GND on GND: 14.87,15.12 15.13,15.12 15.13,10.62 14.87,10.62
GND on GND: 20.92,23.13 23.13,23.13 23.13,20.92 20.92,20.92
GND on GND: 10.62,15.13 15.12,15.13 15.12,14.87 10.62,14.87
GND on GND: 0.26,29.74 29.74,29.74 29.74,0.26 0.26,0.26
GND on GND: 22.87,25.08 25.08,25.08 25.08,22.87 22.87,22.87
GND on GND: 20.57,25.43 23.13,25.43 23.13,22.87 20.57,22.87
GND on GND: 14.88,15.13 19.38,15.13 19.38,14.87 14.88,14.87
GND on GND: 14.87,19.38 15.13,19.38 15.13,14.88 14.87,14.88
GND on POWR: -4.05,33.16 33.16,33.16 33.16,-3.8 -4.05,-3.8
VCC on Top Layer: 6.69,20.9 9.92,20.9 9.92,19.32 6.69,19.32
VCC on Top Layer: 5.79,19.32 7.63,19.32 7.63,12.59 5.79,12.59
VCC on Top Layer: 4.71,20.97 6.87,20.97 6.87,19.32 4.71,19.32

Small or netless copper shapes (teardrops, artwork), in the pictures only: 71 on Top Layer, 82 on Bottom Layer, 28 on POWR

## Text on the board
Bottom Silkscreen Layer: SENSOR2 | SENSOR4 | Final Version | Designed by Mengxin
